# Altium schematic sheet AT short bus ( 7 x 4.8 inches).schdoc: AT short bus ( 7 x 4.8 inches)
size A; Organization: Organization; Address1: Address1; Address2: Address2; Address3: Address3; Address4: Address4; DocumentNumber: 1; Revision: 0; SheetNumber: 2; SheetTotal: 2
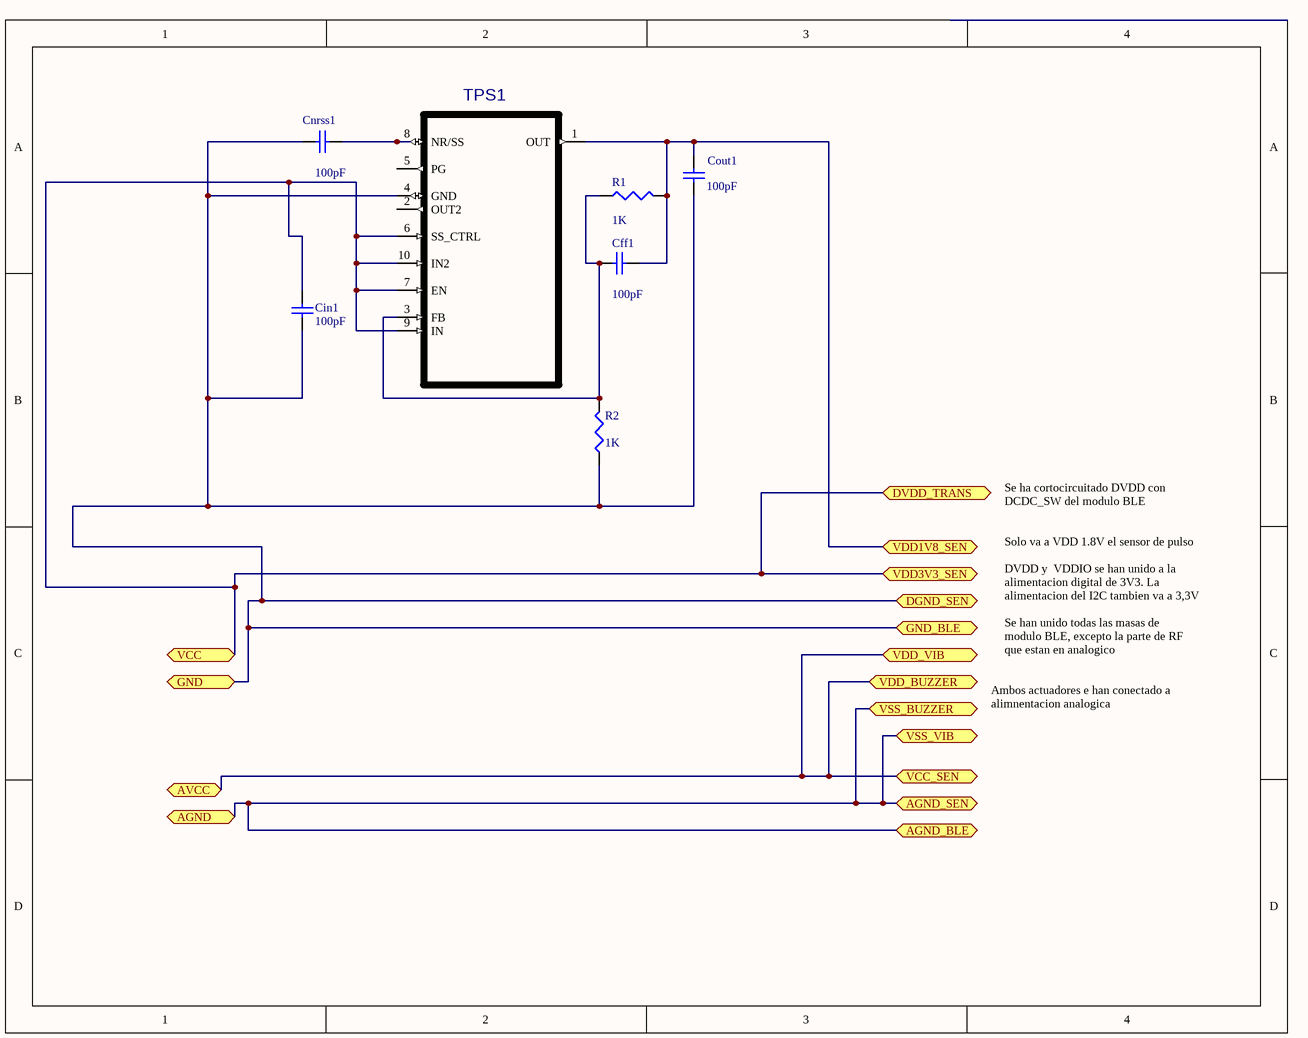
[diagram p0: AT short bus ( 7 x 4.8 inches).schdoc]

## Parts
Cff1  value 100pF  [C1206]
Cin1  value 100pF  [C1206]
Cnrss1  value 100pF  [C1206]
Cout1  value 100pF  [C1206]
R1  value 1K  [J1-0603]
R2  value 1K  [J1-0603]
TPS1  TPS63030DSKT  [SON50P260X260X80-11N]  (value not drawn)

## Ports
AGND, AGND_BLE, AGND_SEN, AVCC, DGND_SEN, DVDD_TRANS, GND (bidir), GND_BLE, VCC, VCC_SEN, VDD1V8_SEN, VDD3V3_SEN, VDD_BUZZER, VDD_VIB, VSS_BUZZER, VSS_VIB

## Nets
AGND: port AGND_SEN, port VSS_BUZZER, port VSS_VIB, port AGND, port AGND_BLE
AVCC: port VCC_SEN, port VDD_BUZZER, port VDD_VIB, port AVCC
DGND_SEN: Cin1.1 Cnrss1.1 Cout1.1 R2.1 TPS1.4(GND) ; port DGND_SEN, port GND, port GND_BLE
DVDD_TRANS: Cin1.2 TPS1.6(SS_CTRL) TPS1.7(EN) TPS1.9(IN) TPS1.10(IN2) ; port VDD3V3_SEN, port VCC, port DVDD_TRANS
VDD1V8_SEN: Cff1.2 Cout1.2 R1.2 TPS1.1(OUT) ; port VDD1V8_SEN
NetCff1_1: Cff1.1 R1.1 R2.2 TPS1.3(FB)
NetCnrss1_2: Cnrss1.2 TPS1.8(NR/SS)

Not connected (* = marked no-connect by the designer): TPS1 2(OUT2) 5(PG) 11(THERMALPAD)

## Notes on the sheet
- Se ha cortocircuitado DVDD con DCDC_SW del modulo BLE
- Solo va a VDD 1.8V el sensor de pulso
- DVDD y  VDDIO se han unido a la alimentacion digital de 3V3. La alimentacion del I2C tambien va a 3,3V
- Se han unido todas las masas de modulo BLE, excepto la parte de RF que estan en analogico
- Ambos actuadores e han conectado a alimnentacion analogica
  AAmbosAmboe ha cortocircuitado DVDD con DCDC_SW del modulo BLE

## Library data of the parts
Cff1 Cin1 Cnrss1 Cout1 = Cap Semi: Capacitor (Semiconductor SIM Model); Published: 8-Jun-2000; LatestRevisionDate: 29-May-2009; LatestRevisionNote: IPC-7351 Footprint Added.; PackageReference: C1206; Publisher: Altium Limited; PackageDescription: Chip Capacitor
R1 R2 = Res3: Resistor; Published: 8-Jun-2000; LatestRevisionDate: 29-May-2009; LatestRevisionNote: IPC-7351 Footprint Added.; PackageReference: J1-0603; Publisher: Altium Limited; PackageDescription: Chip Resistor
TPS1 = TPS63030DSKT: TPS7A91 (ACTIVE)  1-A, High Accuracy, Low Noise LDO Voltage Regulator; MF: Texas Instruments; MP: TPS63030DSKT; Price: 1.51 USD; Package: WSON-10 Texas Instruments; Availability: Good; Value: *